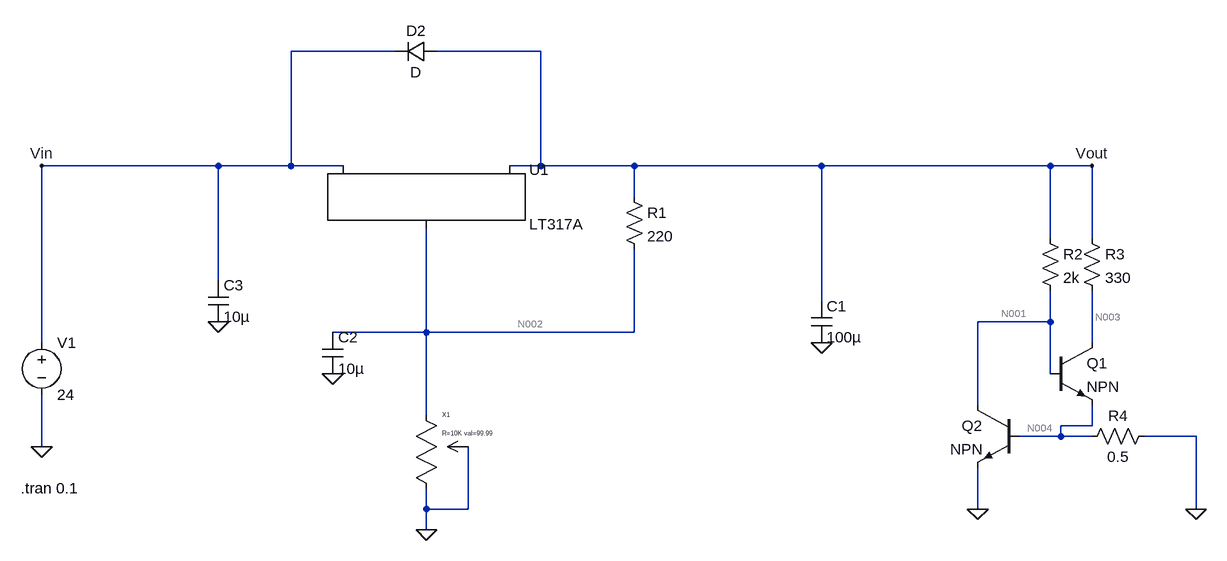
[diagram p0: schematic powerSupply.asc]
powerSupply.asc, the LTspice schematic file:
Version 4.1
SHEET 1 1572 680
WIRE 320 -240 160 -240
WIRE 544 -240 384 -240
WIRE 48 -64 -224 -64
WIRE 160 -64 160 -240
WIRE 160 -64 48 -64
WIRE 240 -64 160 -64
WIRE 544 -64 544 -240
WIRE 544 -64 496 -64
WIRE 688 -64 544 -64
WIRE 976 -64 688 -64
WIRE 1328 -64 976 -64
WIRE 1392 -64 1328 -64
WIRE 688 -16 688 -64
WIRE 1328 48 1328 -64
WIRE 1392 48 1392 -64
WIRE 48 112 48 -64
WIRE 976 144 976 -64
WIRE 1328 176 1328 128
WIRE 1328 176 1216 176
WIRE 368 192 368 32
WIRE 368 192 224 192
WIRE 688 192 688 64
WIRE 688 192 368 192
WIRE -224 208 -224 -64
WIRE 1392 208 1392 128
WIRE 1328 256 1328 176
WIRE 1216 304 1216 176
WIRE 368 320 368 192
WIRE 1392 336 1392 304
WIRE 1392 336 1344 336
WIRE 1344 352 1344 336
WIRE 1344 352 1280 352
WIRE 1392 352 1344 352
WIRE 1552 352 1472 352
WIRE -224 368 -224 288
WIRE 368 464 368 432
WIRE 432 464 432 368
WIRE 432 464 368 464
WIRE 1216 464 1216 400
WIRE 1552 464 1552 352
WIRE 368 496 368 464
FLAG -224 368 0
FLAG 224 256 0
FLAG 48 176 0
FLAG -224 -64 Vin
FLAG 1392 -64 Vout
FLAG 976 208 0
FLAG 368 496 0
FLAG 1216 464 0
FLAG 1552 464 0
SYMBOL voltage -224 192 R0
WINDOW 123 0 0 Left 0
WINDOW 39 0 0 Left 0
SYMATTR InstName V1
SYMATTR Value 24
SYMBOL PowerProducts\\LT317A 368 -64 R0
SYMATTR InstName U1
SYMBOL pot 352 336 R0
WINDOW 39 40 11 Left 0
SYMATTR SpiceLine R=10K val=99.99
SYMATTR InstName X1
SYMBOL cap 208 192 R0
SYMATTR InstName C2
SYMATTR Value 10µ
SYMBOL diode 384 -256 R90
WINDOW 0 0 32 VBottom 2
WINDOW 3 32 32 VTop 2
SYMATTR InstName D2
SYMBOL res 672 -32 R0
SYMATTR InstName R1
SYMATTR Value 220
SYMBOL cap 32 112 R0
SYMATTR InstName C3
SYMATTR Value 10µ
SYMBOL cap 960 144 R0
SYMATTR InstName C1
SYMATTR Value 100µ
SYMBOL npn 1328 208 R0
SYMATTR InstName Q1
SYMBOL res 1312 32 R0
SYMATTR InstName R2
SYMATTR Value 2k
SYMBOL npn 1280 304 M0
SYMATTR InstName Q2
SYMBOL res 1488 336 R90
WINDOW 0 0 56 VBottom 2
WINDOW 3 32 56 VTop 2
SYMATTR InstName R4
SYMATTR Value 0.5
SYMBOL res 1376 32 R0
SYMATTR InstName R3
SYMATTR Value 330
TEXT -256 432 Left 2 !.tran 0.1

The netlist it stands for:
* powerSupply.asc
V1 Vin 0 24
X§U1 N002 Vout Vin LT317A
X§X1 N002 0 0 pot R=10K val=99.99  ; pins 1 2 3
C2 N002 0 10µ
D2 Vout Vin D
R1 Vout N002 220
C3 Vin 0 10µ
C1 Vout 0 100µ
Q1 N003 N001 N004 0 NPN
R2 Vout N001 2k
Q2 N001 N004 0 0 NPN
R4 0 N004 0.5
R3 Vout N003 330
.model D D
.lib standard.dio
.model NPN NPN
.model PNP PNP
.lib standard.bjt
.tran 0.1
.lib LTC.lib
.backanno
.end

* Results of the author's LTspice run, read from the files saved beside the schematic
* Operating Point, zero values left out:
*   V(n001) = 928.2 mV
*   V(n002) = 21.66 V
*   V(n003) = 95.11 mV
*   V(n004) = 38.7 mV
*   V(vin) = 24 V
*   V(vout) = 22.14 V
*   I(D2) = -1.874 pA
*   I(R1) = 2.166 mA
*   I(R2) = 10.6 mA
*   I(R3) = 66.79 mA
*   I(R4) = -77.39 mA
*   I(V1) = -79.56 mA
*   Ib(Q1) = 10.6 mA
*   Ic(Q1) = 66.79 mA
*   Ie(Q1) = -77.39 mA
*   Ix(u1:1) = -105.2 nA
*   Ix(u1:2) = -79.56 mA
*   Ix(u1:3) = 79.56 mA
*   Ix(x1:1) = 2.166 mA
*   Ix(x1:2) = -2.166 mA